# EAGLE design radio_module_V2.0 (EAGLE 7.3.0)
Assembly variants: X4
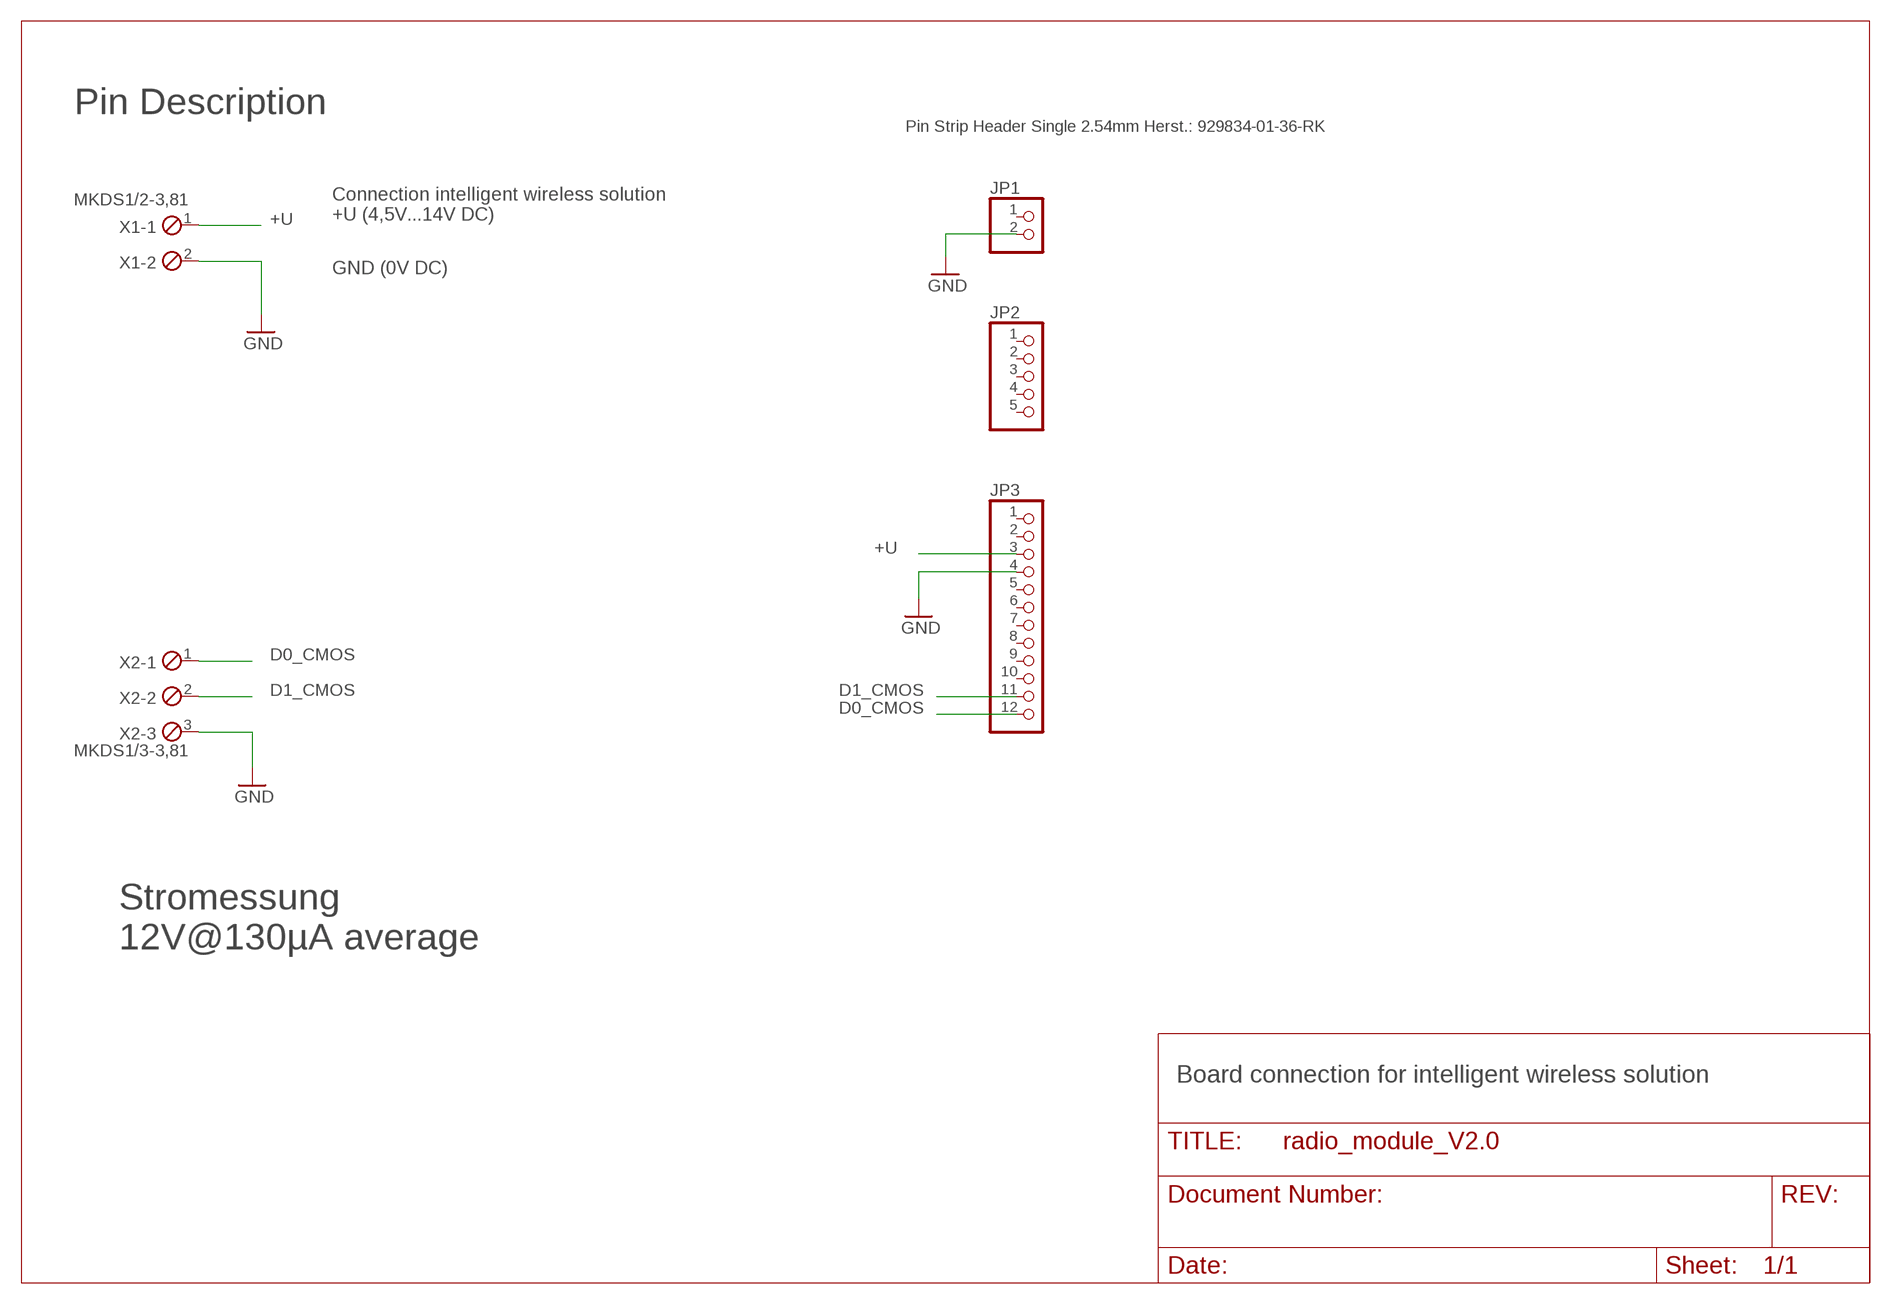
[diagram p0: schematic, sheet 1]

## Parts
JP1  PINHD-1X2  [1X02]
JP2  PINHD-1X5  [1X05]
JP3  PINHD-1X12  [1X12]
X1  MKDS1/2-3,81  [2POL381]
X2  MKDS1/3-3,81  [3POL381]

## Nets
+U: JP3.3 X1.1
D0_CMOS: JP3.12 X2.1
D1_CMOS: JP3.11 X2.2
GND: JP1.2 JP3.4 X1.2 X2.3
Unconnected: JP1.1 JP2.1 JP2.2 JP2.3 JP2.4 JP2.5 JP3.1 JP3.2 JP3.5 JP3.6 JP3.7 JP3.8 JP3.9 JP3.10

## Notes on the sheet
- Pin Description
- Pin Strip Header Single 2.54mm Herst.: 929834-01-36-RK
- Connection intelligent wireless solution
  +U (4,5V...14V DC)
- GND (0V DC)
- Stromessung
  12V@130µA average
- Board connection for intelligent wireless solution

## Library data of the parts
JP1 = pinhead:PINHD-1X2: PIN HEADER
JP2 = pinhead:PINHD-1X5: PIN HEADER
JP3 = pinhead:PINHD-1X12: PIN HEADER
X1 = con-phoenix-381:MKDS1/2-3,81: MKDS 1/2-3,81 - Order No. 1727010 (RS-Online - 101-5384) Pitch: 3,81mm Number of terminals: 2 Rated Voltage: 160V Maximum load current/ cross section: 12A/1.5mm2-AWG16 Housing Interlocking: none Color: Green
X2 = con-phoenix-381:MKDS1/3-3,81: MKDS 1/3-3,81 - Order No. 1727023 (RS-Online - 101-5390) Pitch: 3,81mm Number of terminals: 3 Rated Voltage: 160V Maximum load current/ cross section: 12A/1.5mm2-AWG16 Housing Interlocking: none Color: Green

## Net classes
0 default: width 0.15 mm
1 GND: width 0.2 mm
2 VCC: width 0.25 mm

## Board
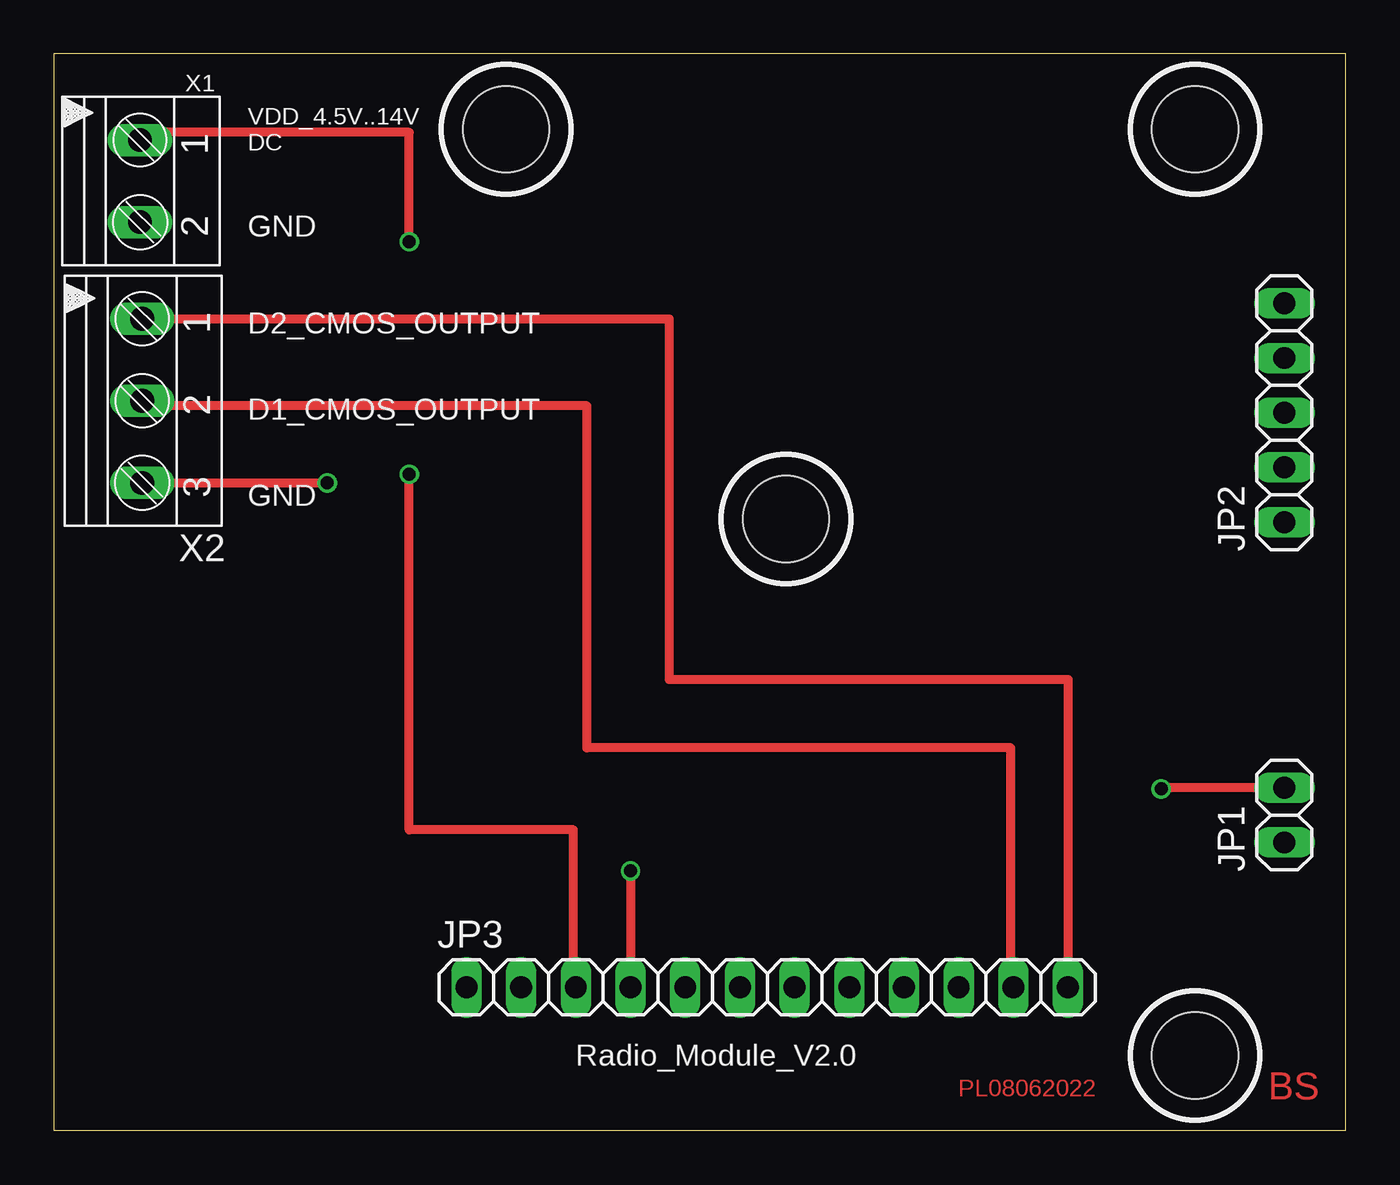
[diagram p1: board, top side]
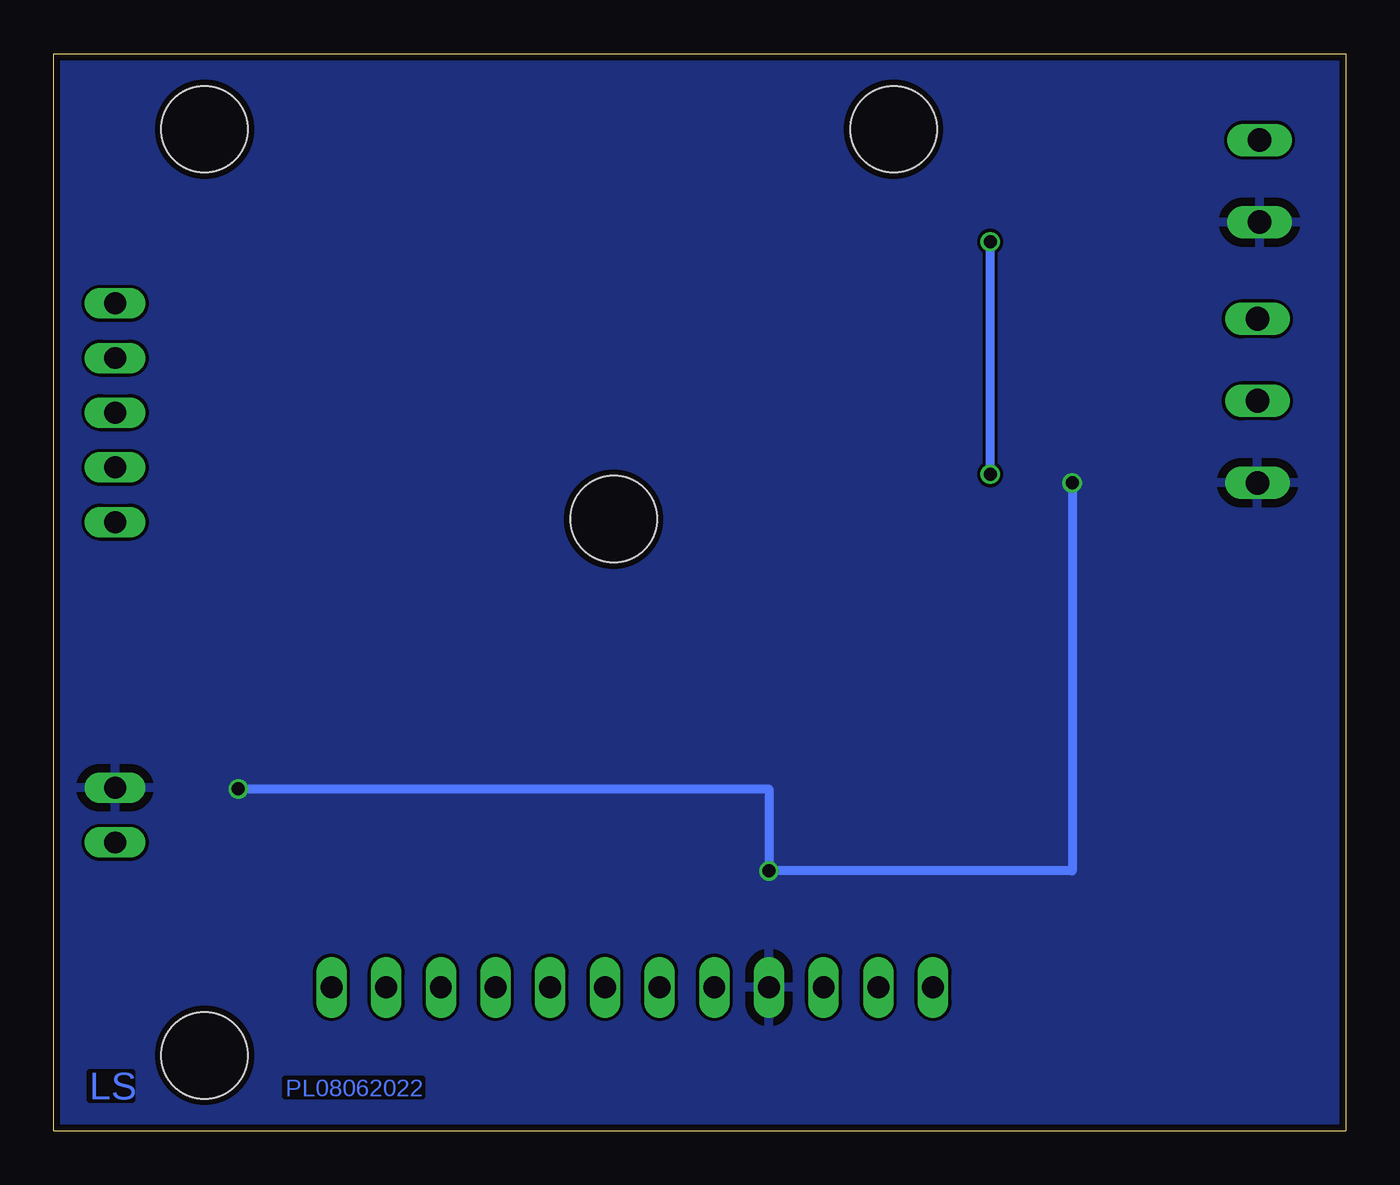
[diagram p2: board, bottom side, seen from below]

Size 60 x 50 mm. Coordinates in mm from the lower left corner, seen from the top.
Outline: 0,50 0,0 60,0 60,50 0,50
Copper layers (1+2*3+16): Top 0.035mm / dielectric 0.2mm / Route2 0.035mm / dielectric 1mm / Route3 0.035mm / dielectric 0.2mm / Bottom 0.035mm
Design rules "default *": minimum track width 0.15mm, minimum drill 0.3mm, track to track 0.15mm, track to pad 0.15mm, pad to pad 0.15mm, via to via 0.15mm, smd to smd 0mil, copper to edge 0.3mm, drill to drill 0.2mm, minimum pad ring 0.2mm, minimum via ring 0.15mm, stop-mask expansion 0.075mm, vias tented up to drill 0mil, thermal gap 0.4mm
Holes 4 mm at 21,46.5 53,3.5 53,46.5 34,28.4
bKeepout: area 0,-5.8 to 45.2,-0.3

### Footprints (pad centres in the part's own frame; a part is rotated, then mirrored left to right if it is on the bottom)
1X02 = drill 1.016 long: 1 -1.27,0; 2 1.27,0
1X05 = drill 1.016 long: 1 -5.08,0; 2 -2.54,0; 3 0,0; 4 2.54,0; 5 5.08,0
1X12 = drill 1.016 long: 1 -13.97,0; 2 -11.43,0; 3 -8.89,0; 4 -6.35,0; 5 -3.81,0; 6 -1.27,0; 7 1.27,0; 8 3.81,0; 9 6.35,0; 10 8.89,0; 11 11.43,0; 12 13.97,0
2POL381 = drill 1.1 long: 1 0,0; 2 3.81,0
3POL381 = drill 1.1 long: 1 0,0; 2 3.81,0; 3 7.62,0

### Placement (x,y rotation side)
JP1  57.15,14.65 90 top
JP2  57.15,33.34 90 top
JP3  33.13,6.66 0 top
X1  4,46 270 top
X2  4.1,37.7 270 top

### Tracks (layer width: path | path; a pad name or v marks a point on that pad's centre or on a via)
+U  (via drill 0.6)
  Top 0.406: JP3.3 24.13,6.66 24.13,13.97 16.51,13.97 v16.51,30.48 | v16.51,41.27 16.51,46.35 4,46.35 X1.1
  Bottom 0.406: v16.51,30.48 v16.51,41.27
D0_CMOS
  Top 0.406: X2.1 28.57,37.7 28.57,20.95 47.1,20.95 JP3.12
D1_CMOS
  Top 0.406: JP3.11 44.45,6.66 44.45,17.78 24.77,17.78 24.77,33.66 4.1,33.66 X2.2
GND  (via drill 0.6)
  Top 0.406: X2.3 v12.7,30.08 | v26.79,12.06 JP3.4 | JP1.2 51.44,15.93 v51.44,15.88
  Bottom 0.406: v12.7,30.08 12.7,12.06 v26.79,12.06 26.79,15.88 v51.44,15.88
  pour Bottom: 0,50 0,0 60,0 60,50 arc-2

### Text on the board
Top: PL08062022 | BS
Bottom: PL08062022 | LS
tNames: VDD_4.5V..14V / DC | GND | D2_CMOS_OUTPUT | D1_CMOS_OUTPUT | GND | Radio_Module_V2.0